# EAGLE design RMP - HALF BRIDGE 0.0.2 (EAGLE 9.6.2)

## Sheet 1 of 5
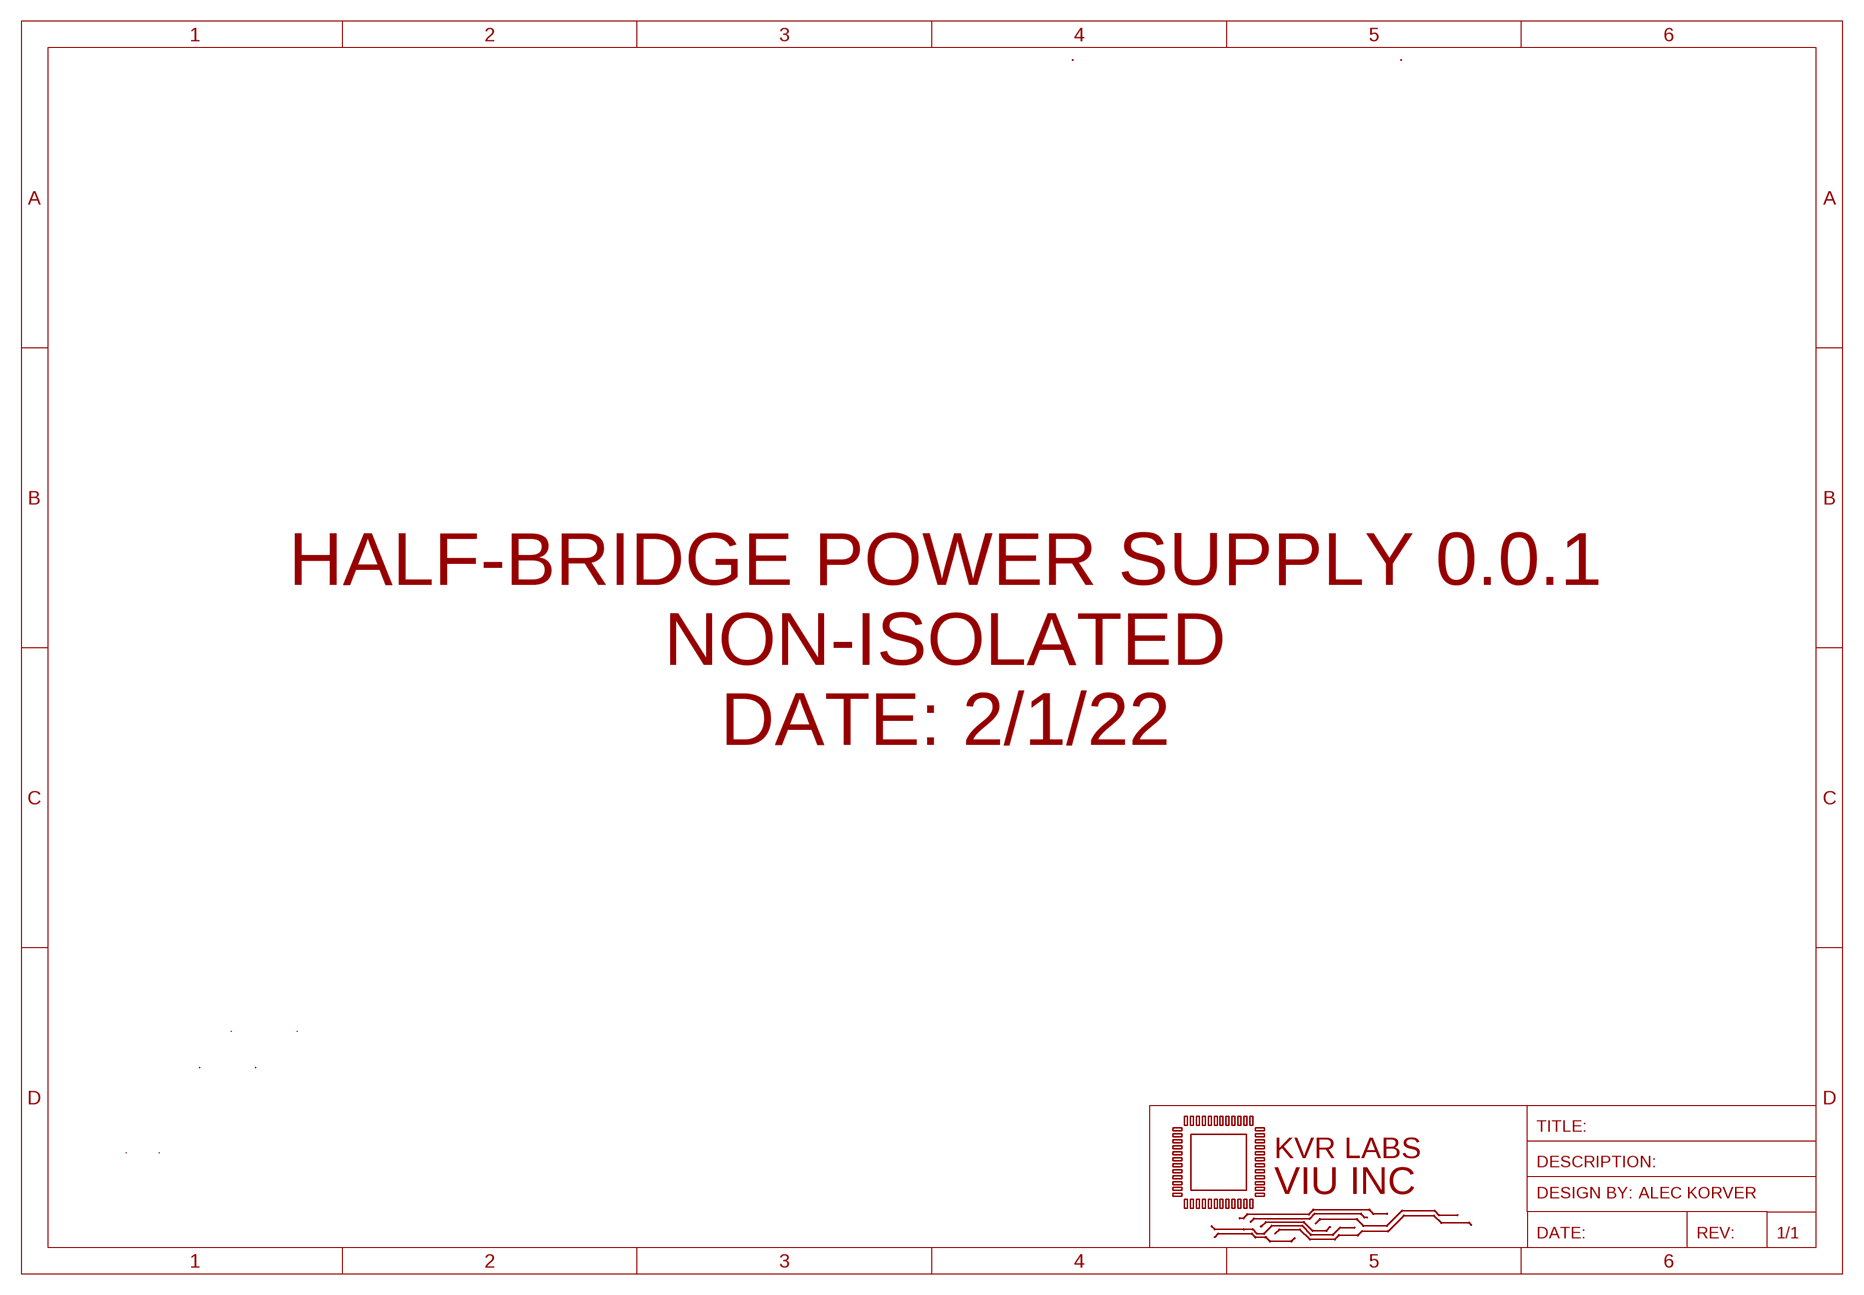
[diagram p0: schematic, sheet 1]

### Notes on the sheet
- HALF-BRIDGE POWER SUPPLY 0.0.1
  NON-ISOLATED
  DATE: 2/1/22

## Sheet 2 of 5: GATE DRIVERS
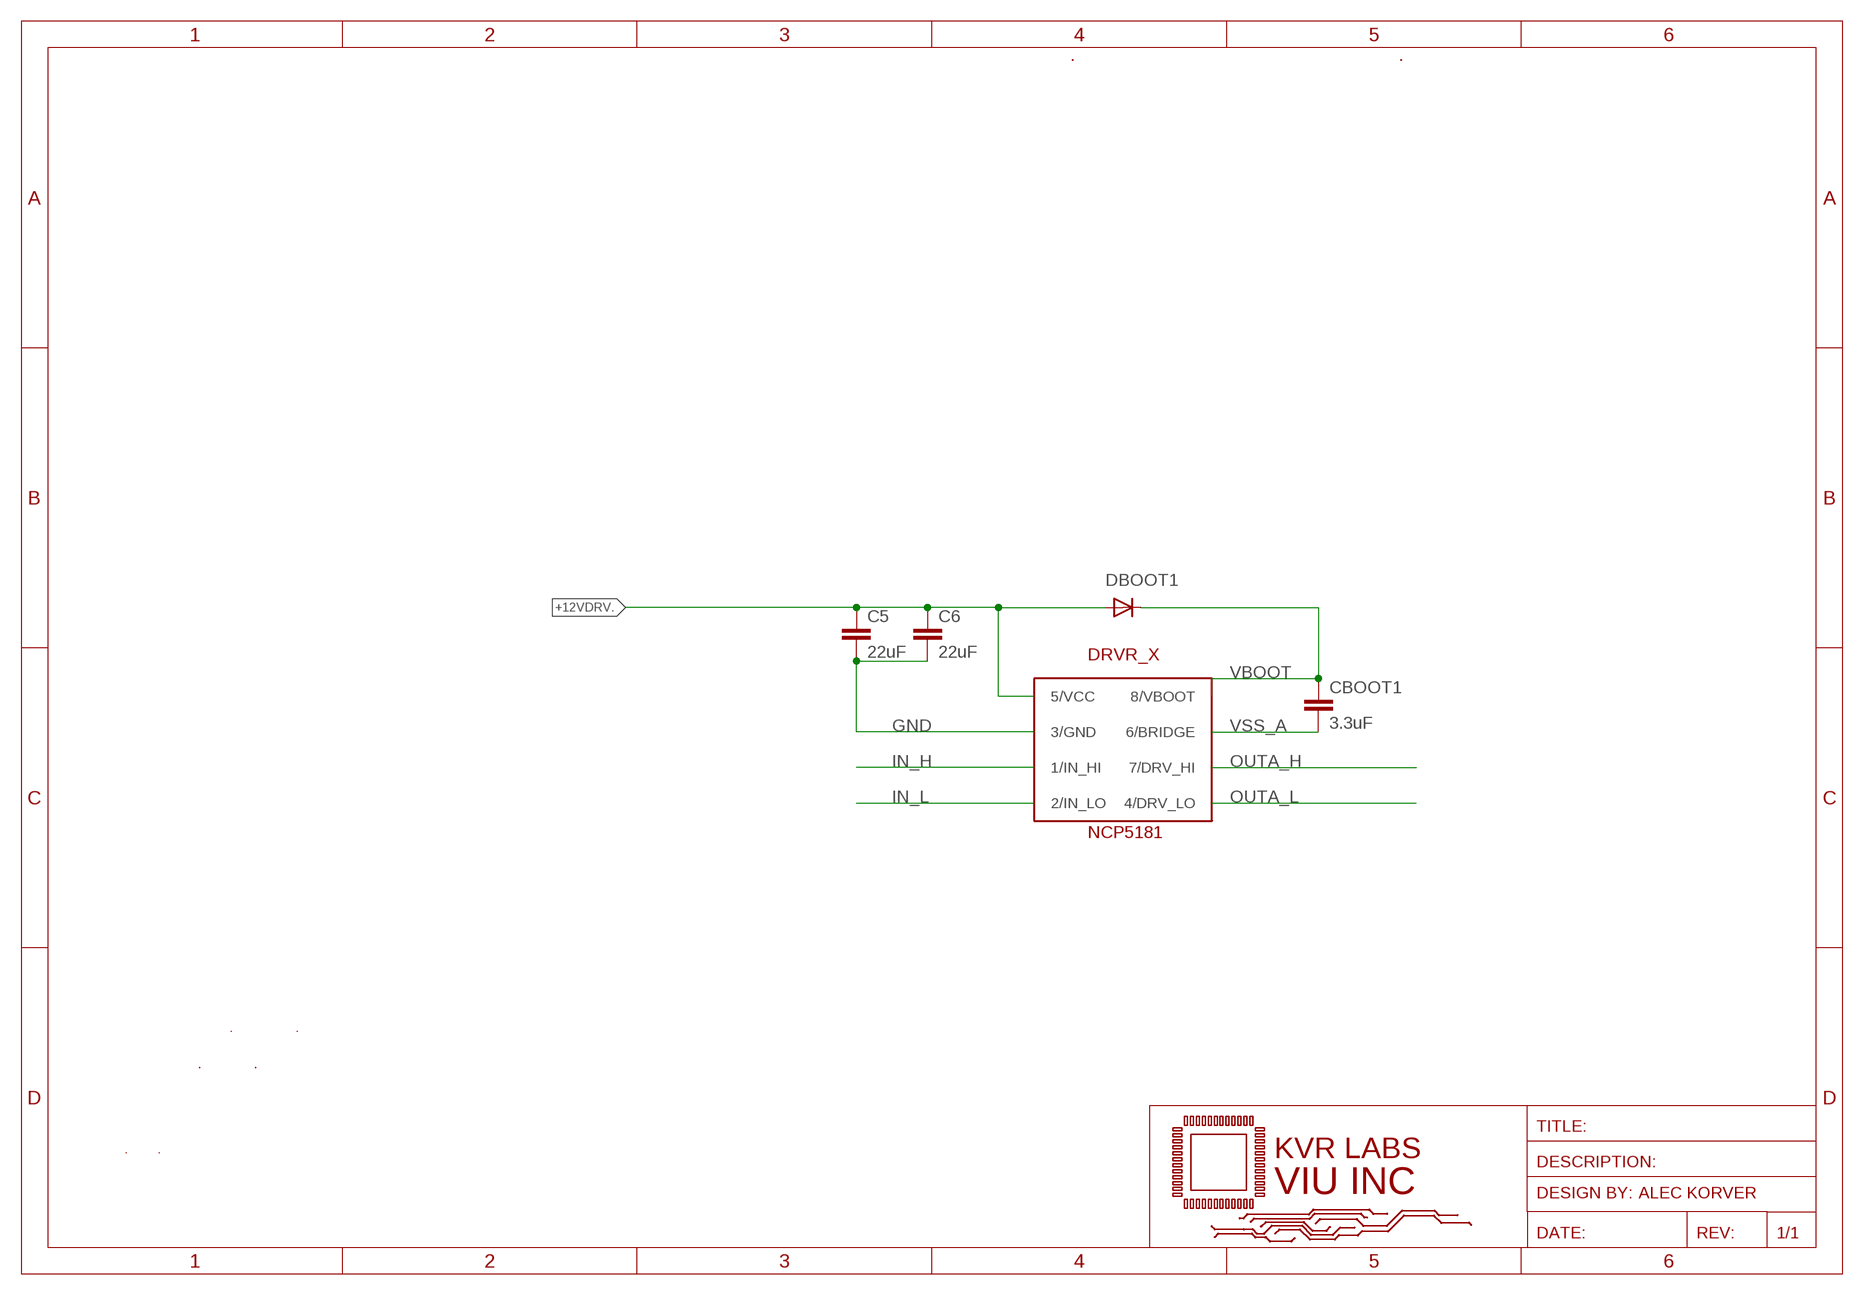
[diagram p1: schematic, sheet 2]

### Parts
C5  22uF  C-EUC1206  [C1206]
C6  22uF  C-EUC1206  [C1206]
CBOOT1  3.3uF  C-EUC1812  [C1812]
DBOOT1  DIODESMA  [SMADIODE]
DRVR_X  NCP5181  [8-SOIC]

### Nets
+12VDRV: C5.1 C6.1 DBOOT1.A DRVR_X.5(5/VCC) ; also sheet 4
GND: C5.2 C6.2 DRVR_X.3(3/GND) ; also sheet 3,4,5
IN_H: DRVR_X.1(1/IN_HI) ; also sheet 4
IN_L: DRVR_X.2(2/IN_LO) ; also sheet 4
OUTA_H: DRVR_X.7(7/DRV_HI) ; also sheet 3
OUTA_L: DRVR_X.4(4/DRV_LO) ; also sheet 3
VBOOT: CBOOT1.1 DBOOT1.C DRVR_X.8(8/VBOOT)
VSS_A: CBOOT1.2 DRVR_X.6(6/BRIDGE) ; also sheet 3,4

## Sheet 3 of 5: H BRIDGE - AC/DC STAGE
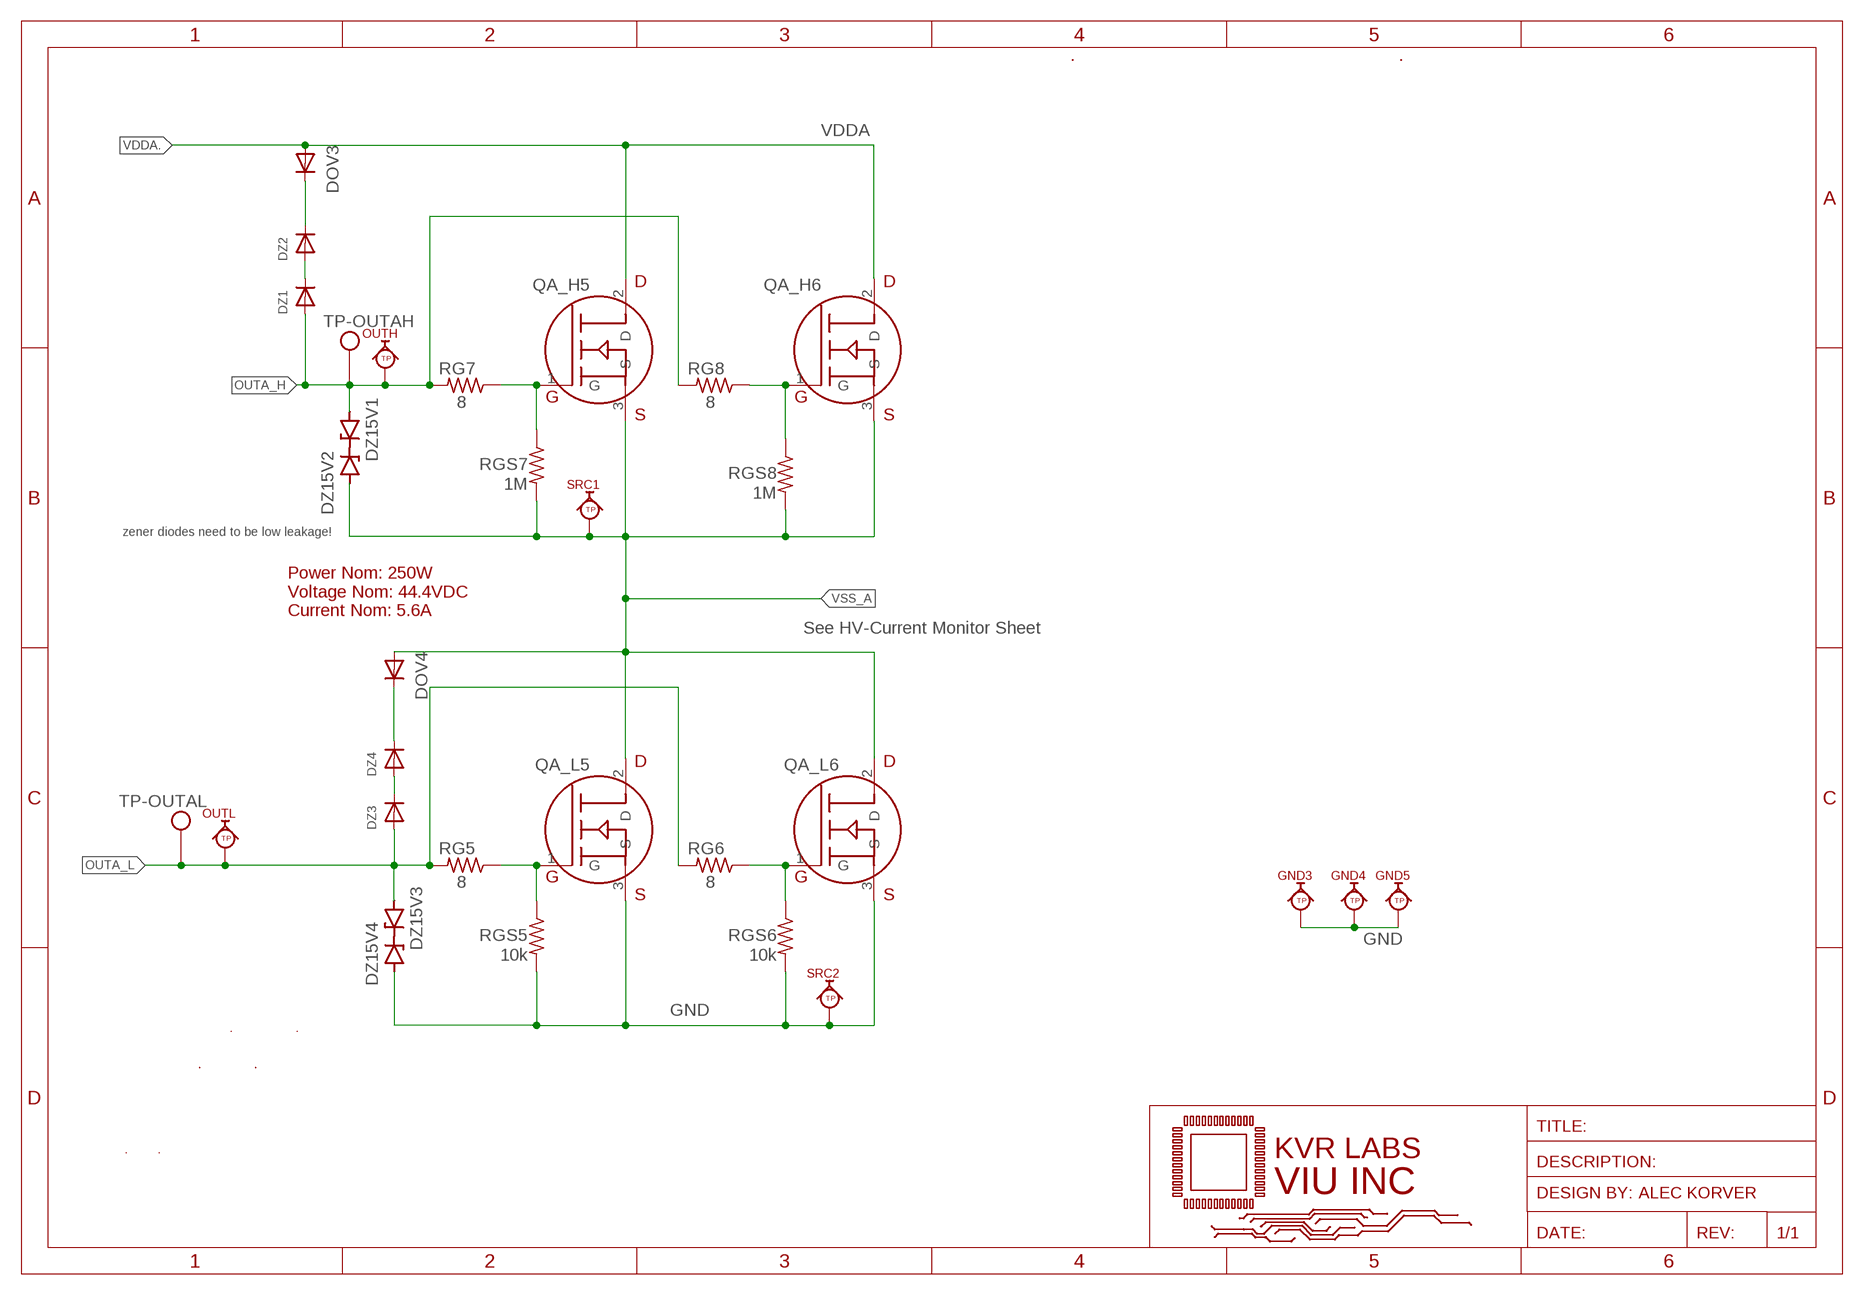
[diagram p2: schematic, sheet 3]

### Parts
DOV3  DIODESMA  [SMADIODE]
DOV4  DIODESMA  [SMADIODE]
DZ1  DIODESMA  [SMADIODE]
DZ2  DIODESMA  [SMADIODE]
DZ3  DIODESMA  [SMADIODE]
DZ4  DIODESMA  [SMADIODE]
DZ15V1  NZH15B,115  ZENER_MMSZ5240BTDO-219-AB(SOD123F)  [SODFL3718X115]
DZ15V2  NZH15B,115  ZENER_MMSZ5240BTDO-219-AB(SOD123F)  [SODFL3718X115]
DZ15V3  NZH15B,115  ZENER_MMSZ5240BTDO-219-AB(SOD123F)  [SODFL3718X115]
DZ15V4  NZH15B,115  ZENER_MMSZ5240BTDO-219-AB(SOD123F)  [SODFL3718X115]
GND3  KEYSTONE_5190_SMT  [KEYSTONE_5190_SMT]
GND4  KEYSTONE_5190_SMT  [KEYSTONE_5190_SMT]
GND5  KEYSTONE_5190_SMT  [KEYSTONE_5190_SMT]
OUTH  KEYSTONE_5190_SMT  [KEYSTONE_5190_SMT]
OUTL  KEYSTONE_5190_SMT  [KEYSTONE_5190_SMT]
QA_H5  IPB60R060P7ATMA1  [D2PACK]
QA_H6  IPB60R060P7ATMA1  [D2PACK]
QA_L5  IPB60R060P7ATMA1  [D2PACK]
QA_L6  IPB60R060P7ATMA1  [D2PACK]
RG5  8  R-US_R1206  [R1206]
RG6  8  R-US_R1206  [R1206]
RG7  8  R-US_R1206  [R1206]
RG8  8  R-US_R1206  [R1206]
RGS5  10k  R-US_R1206  [R1206]
RGS6  10k  R-US_R1206  [R1206]
RGS7  1M  R-US_R1206  [R1206]
RGS8  1M  R-US_R1206  [R1206]
SRC1  KEYSTONE_5190_SMT  [KEYSTONE_5190_SMT]
SRC2  KEYSTONE_5190_SMT  [KEYSTONE_5190_SMT]
TP-OUTAH  THM_TESTPOINT_5000_SERIES  [THM-TESTPOINT]
TP-OUTAL  THM_TESTPOINT_5000_SERIES  [THM-TESTPOINT]

### Nets
GND: DZ15V4.2(A) GND3.P$1 GND4.P$1 GND5.P$1 QA_L5.3(S) QA_L6.3(S) RGS5.2 RGS6.2 SRC2.P$1 ; also sheet 2,4,5
N$1: DZ1.C DZ2.A
N$2: DOV4.C DZ4.C
N$3: DZ3.C DZ4.A
N$31: DZ15V3.1(C) DZ15V4.1(C)
N$38: DZ15V1.1(C) DZ15V2.1(C)
N$43: QA_L6.1(G) RG6.1 RGS6.1
N$44: QA_H6.1(G) RG8.1 RGS8.1
N$45: QA_H5.1(G) RG7.1 RGS7.1
N$46: QA_L5.1(G) RG5.1 RGS5.1
N$47: DOV3.C DZ2.C
OUTA_H: DZ1.A DZ15V1.2(A) OUTH.P$1 RG7.2 RG8.2 TP-OUTAH.P1 ; also sheet 2
OUTA_L: DZ3.A DZ15V3.2(A) OUTL.P$1 RG5.2 RG6.2 TP-OUTAL.P1 ; also sheet 2
VDDA: DOV3.A QA_H5.2(D) QA_H6.2(D) ; also sheet 4,5
VSS_A: DOV4.A DZ15V2.2(A) QA_H5.3(S) QA_H6.3(S) QA_L5.2(D) QA_L6.2(D) RGS7.2 RGS8.2 SRC1.P$1 ; also sheet 2,4

### Notes on the sheet
- zener diodes need to be low leakage!
- Power Nom: 250W
  Voltage Nom: 44.4VDC
  Current Nom: 5.6A
- See HV-Current Monitor Sheet

## Sheet 4 of 5: CONNECTORS
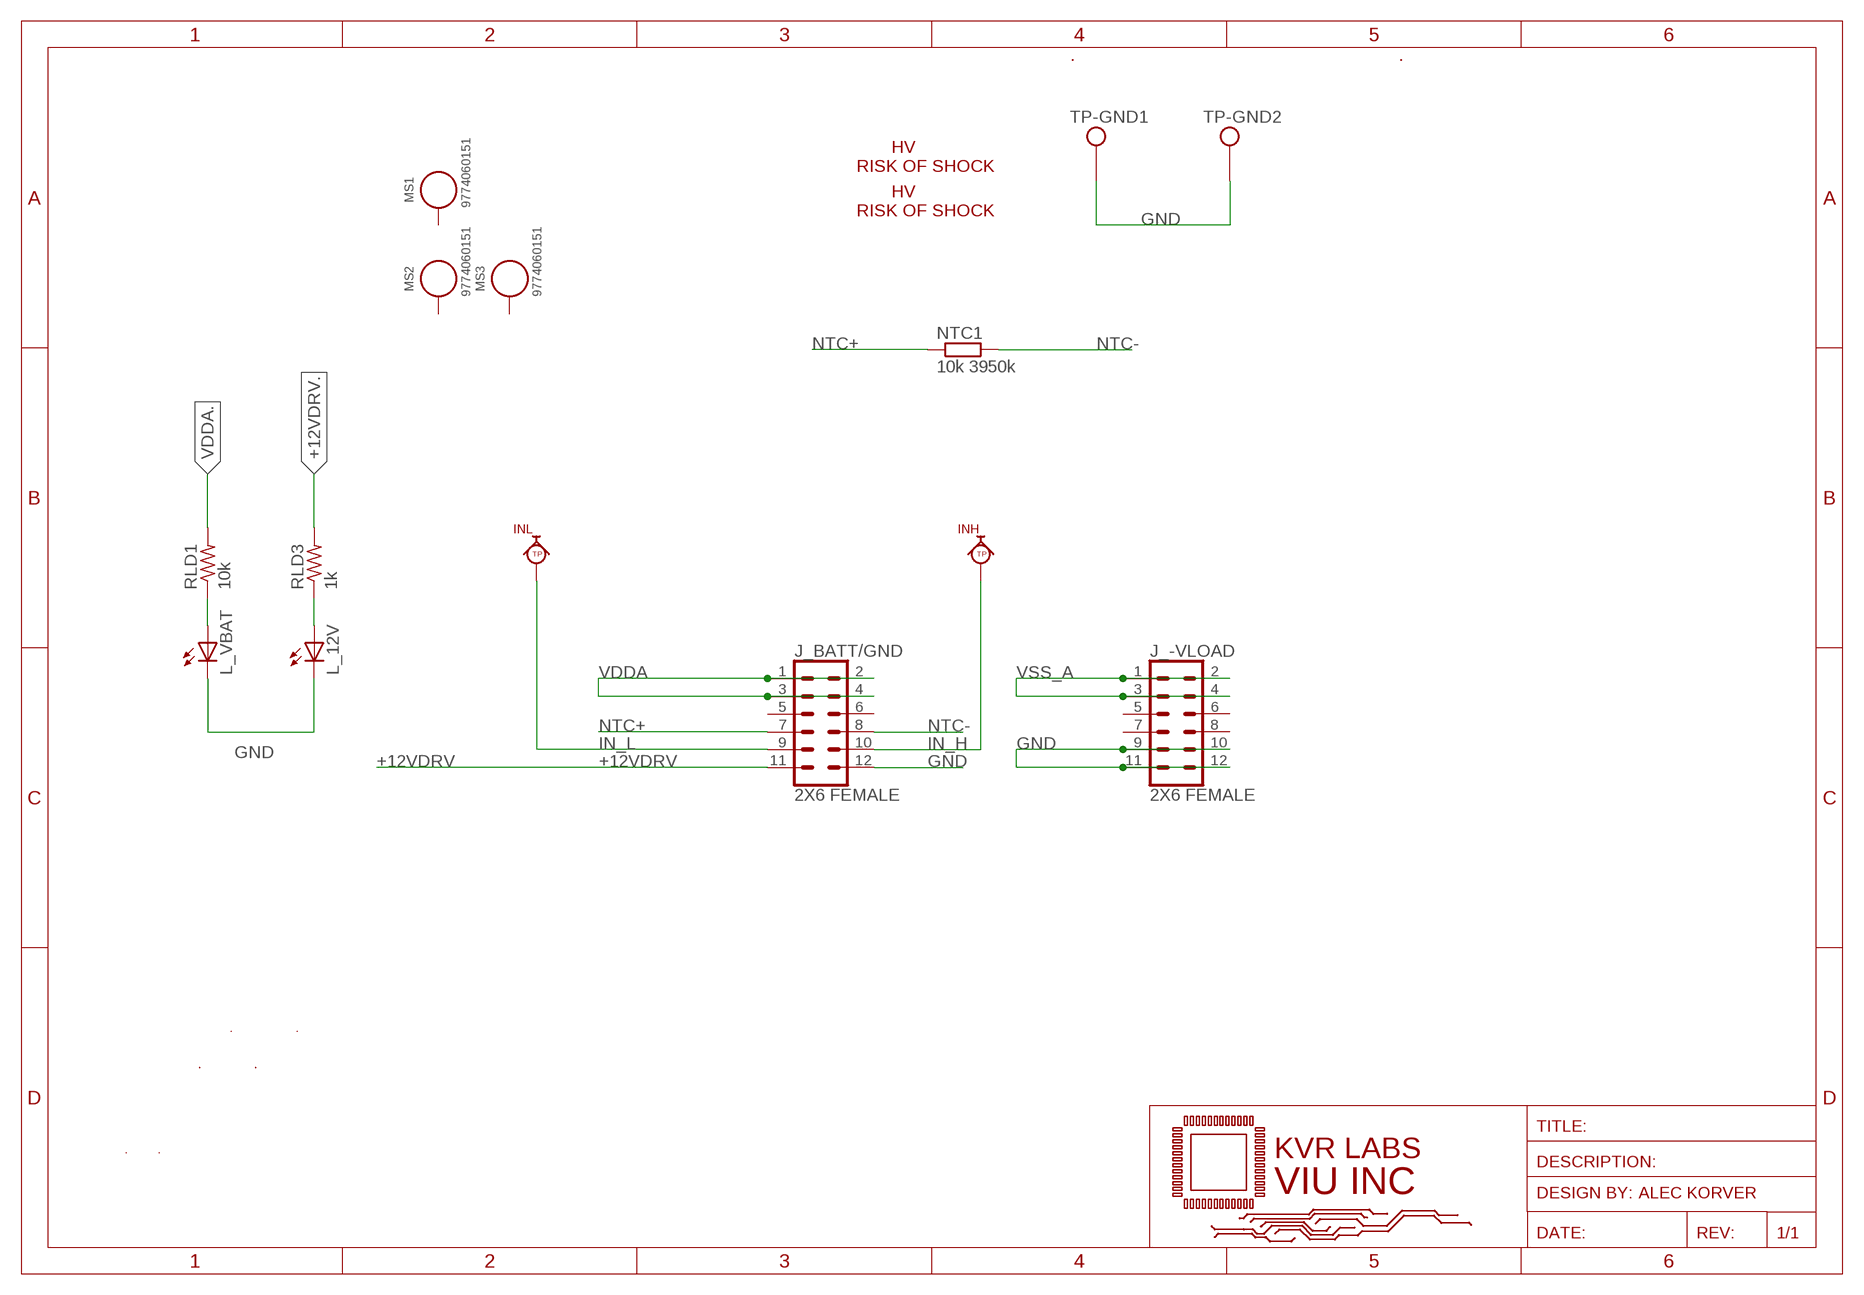
[diagram p3: schematic, sheet 4]

### Parts
INH  KEYSTONE_5190_SMT  [KEYSTONE_5190_SMT]
INL  KEYSTONE_5190_SMT  [KEYSTONE_5190_SMT]
J_-VLOAD  2X6 FEMALE  CONN_06X2PTH_FEMALE  [2X6]
J_BATT/GND  2X6 FEMALE  CONN_06X2PTH_FEMALE  [2X6]
L_12V  LEDCHIPLED_1206  [CHIPLED_1206]
L_VBAT  LEDCHIPLED_1206  [CHIPLED_1206]
MS1  9774060151  WA-SMSI_9774XXX151_9774060151  [WA-SMSI_9774060151]
MS2  9774060151  WA-SMSI_9774XXX151_9774060151  [WA-SMSI_9774060151]
MS3  9774060151  WA-SMSI_9774XXX151_9774060151  [WA-SMSI_9774060151]
NTC1  10k 3950k  R-EU_R0805  [R0805]
RLD1  10k  R-US_R1206  [R1206]
RLD3  1k  R-US_R1206  [R1206]
TP-GND1  THM_TESTPOINT_5000_SERIES  [THM-TESTPOINT]
TP-GND2  THM_TESTPOINT_5000_SERIES  [THM-TESTPOINT]
U$10  ELECTRIC_SHOCK  [ELECTRIC_SHOCK]
U$11  ELECTRIC_SHOCK  [ELECTRIC_SHOCK]

### Nets
+12VDRV: J_BATT/GND.11 RLD3.2 ; also sheet 2
GND: J_-VLOAD.9 J_-VLOAD.10 J_-VLOAD.11 J_-VLOAD.12 J_BATT/GND.12 L_12V.C L_VBAT.C TP-GND1.P1 TP-GND2.P1 ; also sheet 2,3,5
IN_H: INH.P$1 J_BATT/GND.10 ; also sheet 2
IN_L: INL.P$1 J_BATT/GND.9 ; also sheet 2
N$17: L_VBAT.A RLD1.1
N$20: L_12V.A RLD3.1
NTC+: J_BATT/GND.7 NTC1.1
NTC-: J_BATT/GND.8 NTC1.2
VDDA: J_BATT/GND.1 J_BATT/GND.2 J_BATT/GND.3 J_BATT/GND.4 RLD1.2 ; also sheet 3,5
VSS_A: J_-VLOAD.1 J_-VLOAD.2 J_-VLOAD.3 J_-VLOAD.4 ; also sheet 2,3
Unconnected: J_-VLOAD.5 J_-VLOAD.6 J_-VLOAD.7 J_-VLOAD.8 J_BATT/GND.5 J_BATT/GND.6 MS1.1 MS2.1 MS3.1

## Sheet 5 of 5: CERAMIC DC LINK CAPACITANCE
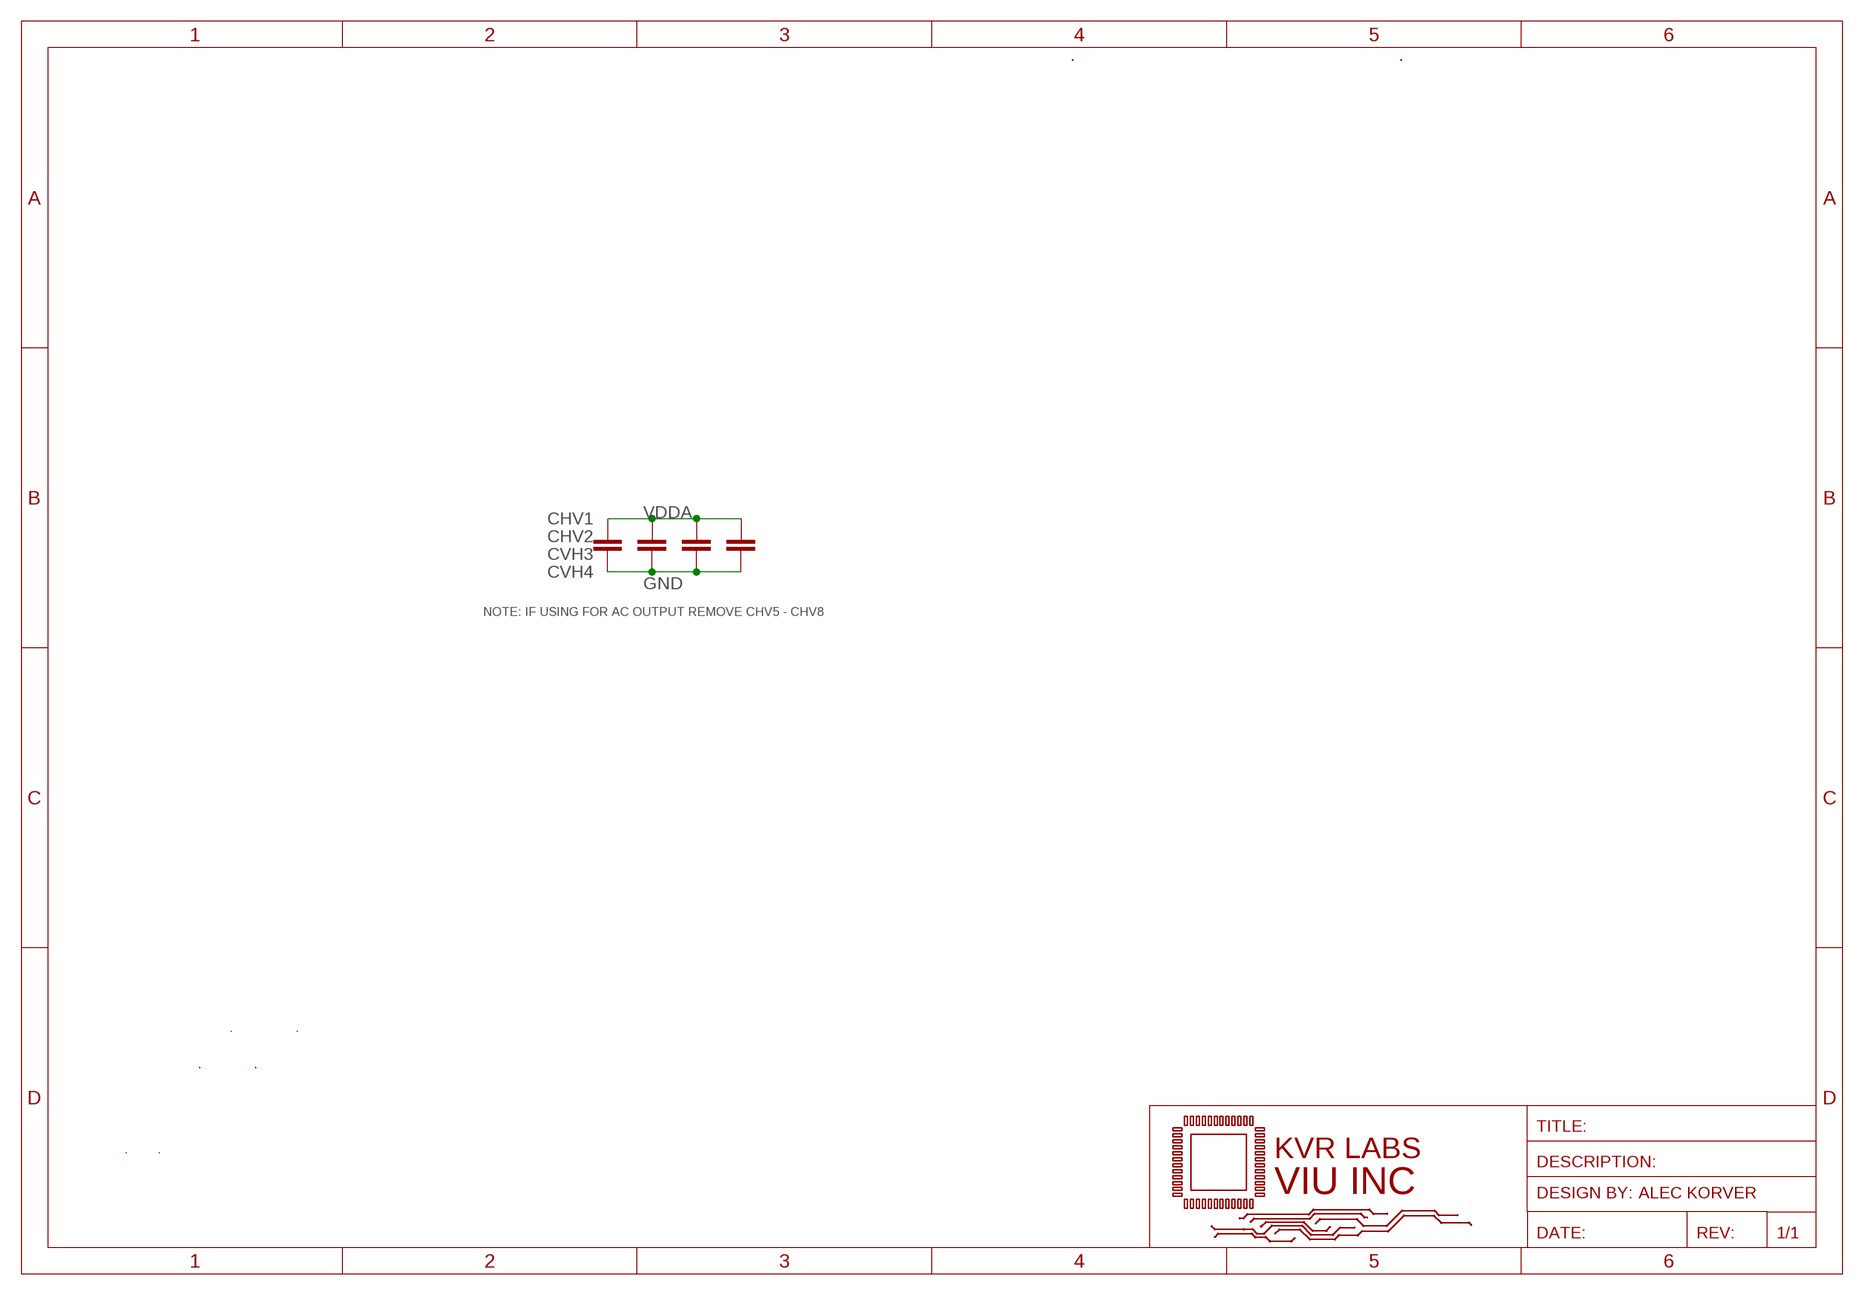
[diagram p4: schematic, sheet 5]

### Parts
CHV1  3.3uF, 100V  C-EUC2220K  [C2220K]
CHV2  3.3uF, 100V  C-EUC2220K  [C2220K]
CVH3  3.3uF, 100V  C-EUC2220K  [C2220K]
CVH4  3.3uF, 100V  C-EUC2220K  [C2220K]

### Nets
GND: CHV1.2 CHV2.2 CVH3.2 CVH4.2 ; also sheet 2,3,4
VDDA: CHV1.1 CHV2.1 CVH3.1 CVH4.1 ; also sheet 3,4

### Notes on the sheet
- NOTE: IF USING FOR AC OUTPUT REMOVE CHV5 - CHV8

## Library data of the parts
C5 C6 = rcl:C-EU: CAPACITOR, European symbol; LCSC_PART: C77091; SPICEPREFIX: C
CBOOT1 = rcl:C-EU: CAPACITOR, European symbol; LCSC_PART: C342636; SPICEPREFIX: C
CHV1 CHV2 CVH3 CVH4 = rcl:C-EU: CAPACITOR, European symbol; LCSC_PART: DNP/C342270; SPICEPREFIX: C
DBOOT1 = adafruit:DIODE: Diode SMADIODE - SMA Surface Mount Package 20V 1A Schottky Diode Digikey: 641-1014-6-ND DO-1N4148 - Through Hole Small Current Diode SOD-123 20V 1 A (.5mV Vf) Schottky Diode - Digikey: MBRX120TPMSCT-ND SOD-323 10V 570mA (.38mV Vf, 3ns) Schottky Diode - Digikey: ZLLS410CT-ND SOD-523 30V 30mA Schottky Diode (RB751S-40TE61) - Digikey: RB751S-40TE61CT-ND SOT23-R/W - SOT23 Package (R = Solder Paste/Reflow Ovens, W = Hand-Soldering) BAT54Film 40V 300mA - Digikey: 497-7162-1-ND; LCSC_PART: C110531
DOV3 DOV4 = adafruit:DIODE: Diode SMADIODE - SMA Surface Mount Package 20V 1A Schottky Diode Digikey: 641-1014-6-ND DO-1N4148 - Through Hole Small Current Diode SOD-123 20V 1 A (.5mV Vf) Schottky Diode - Digikey: MBRX120TPMSCT-ND SOD-323 10V 570mA (.38mV Vf, 3ns) Schottky Diode - Digikey: ZLLS410CT-ND SOD-523 30V 30mA Schottky Diode (RB751S-40TE61) - Digikey: RB751S-40TE61CT-ND SOT23-R/W - SOT23 Package (R = Solder Paste/Reflow Ovens, W = Hand-Soldering) BAT54Film 40V 300mA - Digikey: 497-7162-1-ND; I_AVG: 1A; LCSC_PART: C110531; VF: 1.3V; VR: 400V
DRVR_X = KVRLABS-Gatedrivers:NCP5181; LCSC_PART: DNP
DZ1-DZ4 = adafruit:DIODE: Diode SMADIODE - SMA Surface Mount Package 20V 1A Schottky Diode Digikey: 641-1014-6-ND DO-1N4148 - Through Hole Small Current Diode SOD-123 20V 1 A (.5mV Vf) Schottky Diode - Digikey: MBRX120TPMSCT-ND SOD-323 10V 570mA (.38mV Vf, 3ns) Schottky Diode - Digikey: ZLLS410CT-ND SOD-523 30V 30mA Schottky Diode (RB751S-40TE61) - Digikey: RB751S-40TE61CT-ND SOT23-R/W - SOT23 Package (R = Solder Paste/Reflow Ovens, W = Hand-Soldering) BAT54Film 40V 300mA - Digikey: 497-7162-1-ND; LCSC_PART: C362303; MODEL: BZG03C180; VZ_NOM: 180V
DZ15V1-DZ15V4 = Diode:ZENER_: Zener Diode - Popular parts; CATEGORY: Diode; DESCRIPTION: DIODE ZENER 10V 500MW SOD123; LCSC_PART: C173428; MANUFACTURER: ON Semiconductor; MPN: MMSZ5240BT1G; SUB-CATEGORY: Zener; THERMALLOSS: 0.5W; VALUE: MMSZ5240BT1G
GND3-GND5 INH INL OUTH OUTL SRC1 SRC2 = KVRLABS-Test Points:KEYSTONE_5190_SMT
J_-VLOAD J_BATT/GND = SparkFun-Connectors:CONN_06X2: Multi connection point. Often used as Generic Header-pin footprint for 0.1 inch spaced/style header connections On any of the 0.1 inch spaced packages, you can populate with these: Break Away Headers - Straight <https://www.sparkfun.com/products/116> (PRT-00116) Break Away Male Headers - Right Angle <https://www.sparkfun.com/products/553> (PRT-00553) Female Headers <https://www.sparkfun.com/products/115> (PRT-00115) Break Away Headers - Machine Pin <https://www.sparkfun.com/products/117> (PRT-00117) Break Away Female Headers - Swiss Machine Pin <https://www.sparkfun.com/products/743> (PRT-00743); LCSC_PART: DNP; MODEL: TSW-106-05-G-D; PROD_ID: CONN-12423
L_12V L_VBAT = adafruit:LED: LED OSRAM: - CHIPLED LG R971, LG N971, LY N971, LG Q971, LY Q971, LO R971, LY R971 LH N974, LH R974 LS Q976, LO Q976, LY Q976 LO Q996 - Hyper CHIPLED LW Q18S LB Q993, LB Q99A, LB R99A - SideLED LS A670, LO A670, LY A670, LG A670, LP A670 LB A673, LV A673, LT A673, LW A673 LH A674 LY A675 LS A676, LA A676, LO A676, LY A676, LW A676 LS A679, LY A679, LG A679 - Hyper Micro SIDELED® LS Y876, LA Y876, LO Y876, LY Y876 LT Y87S - SmartLED LW L88C, LW L88S LB L89C, LB L89S, LG L890 LS L89K, LO L89K, LY L89K LS L896, LA L896, LO L896, LY L896 - TOPLED LS T670, LO T670, LY T670, LG T670, LP T670 LSG T670, LSP T670, LSY T670, LOP T670, LYG T670 LG T671, LOG T671, LSG T671 LB T673, LV T673, LT T673, LW T673 LH T674 LS T676, LA T676, LO T676, LY T676, LB T676, LH T676, LSB T676, LW T676 LB T67C, LV T67C, LT T67C, LS T67K, LO T67K, LY T67K, LW E67C LS E67B, LA E67B, LO E67B, LY E67B, LB E67C, LV E67C, LT E67C LW T67C LS T679, LY T679, LG T679 LS T770, LO T770, LY T770, LG T770, LP T770 LB T773, LV T773, LT T773, LW T773 LH T774 LS E675, LA E675, LY E675, LS T675 LS T776, LA T776, LO T776, LY T776, LB T776 LHGB T686 LT T68C, LB T68C - Hyper Mini TOPLED® LB M676 - Mini TOPLED Santana® LG M470 LS M47K, LO M47K, LY M47K Source: http://www.osram.convergy.de/; LCSC_PART: C434439
MS1-MS3 = Eagle_WA-SMSI (rev20d) (1):WA-SMSI_9774XXX151: WA-SMSI SMT Steel Spacer, M2.5 Thread Internal PROPERTIES Material Steel Surface Tin GENERAL INFORMATION Operating Temperature -55 up to +150 °C PACKAGING PROPERTIES Packaging Bag;​ Tape and Reel;​ Bulk Packaging Unit 450 <https://katalog.we-online.de/media/images/v2/o92910v209%20Family_WA-SMSI_M2-M2.5.jpg> Details see: https://katalog.we-online.de/en/em/SMSI_SMT_STEEL_SPACER_M2_5_THREAD_INTERNAL Updated by Ella Wu 2020-05-18 2020(C) Wurth Elektronik; DATASHEET-URL: https://www.we-online.de/katalog/datasheet/9774060151.pdf; INNER-DIAMETER: 3.5mm; INNER-THREAD-LENGTH: -; LCSC_PART: DNP; OUTER-DIAMETER: 5.1mm; PART-NUMBER: 9774060151; PIN-LENGTH: 6mm; THREAD: M2.5
NTC1 = rcl:R-EU_: RESISTOR, European symbol; BETA: 3950K; LCSC_PART: C95968; RESISTANCE: 10k; SPICEPREFIX: R
QA_H5 QA_H6 QA_L5 QA_L6 = PSFBC:IPB60R060P7ATMA1: IPB60R060P7ATMA1 VDS: 650V Id: 48A(Tc) Rdson: 60mOhm Vgsth: 4V https://www.digikey.com/product-detail/en/infineon-technologies/IPB60R060P7ATMA1/IPB60R060P7ATMA1CT-ND/8259678; CISS: 4050pF; COSS: 1480pF; CRSS: 58pF; LCSC_PART: C604524; MODEL: SQM10250E_GE3; QGC: 75nC; RDSON: 30mOhm; TDELAY: 60ns; TFALL: 20ns; TRISE: 30ns; VDS: 250V; VGSMAX: +/- 20V; VGSTH: 3.5V
RG5-RG8 = rcl:R-US_: RESISTOR, American symbol; LCSC_PART: C118070; SPICEPREFIX: R
RGS5 RGS6 RLD1 = rcl:R-US_: RESISTOR, American symbol; LCSC_PART: C140407; SPICEPREFIX: R
RGS7 RGS8 = rcl:R-US_: RESISTOR, American symbol; LCSC_PART: C105578; SPICEPREFIX: R
RLD3 = rcl:R-US_: RESISTOR, American symbol; LCSC_PART: C115421; SPICEPREFIX: R
TP-GND1 TP-GND2 TP-OUTAH TP-OUTAL = PSFBC:THM_TESTPOINT_5000_SERIES; LCSC_PART: DNP
U$10 U$11 = PSFBC:ELECTRIC_SHOCK; LCSC_PART: DNP

## Net classes
0 default: width 0.089 mm, drill 0.2 mm, clearance 0.089 mm

## Board
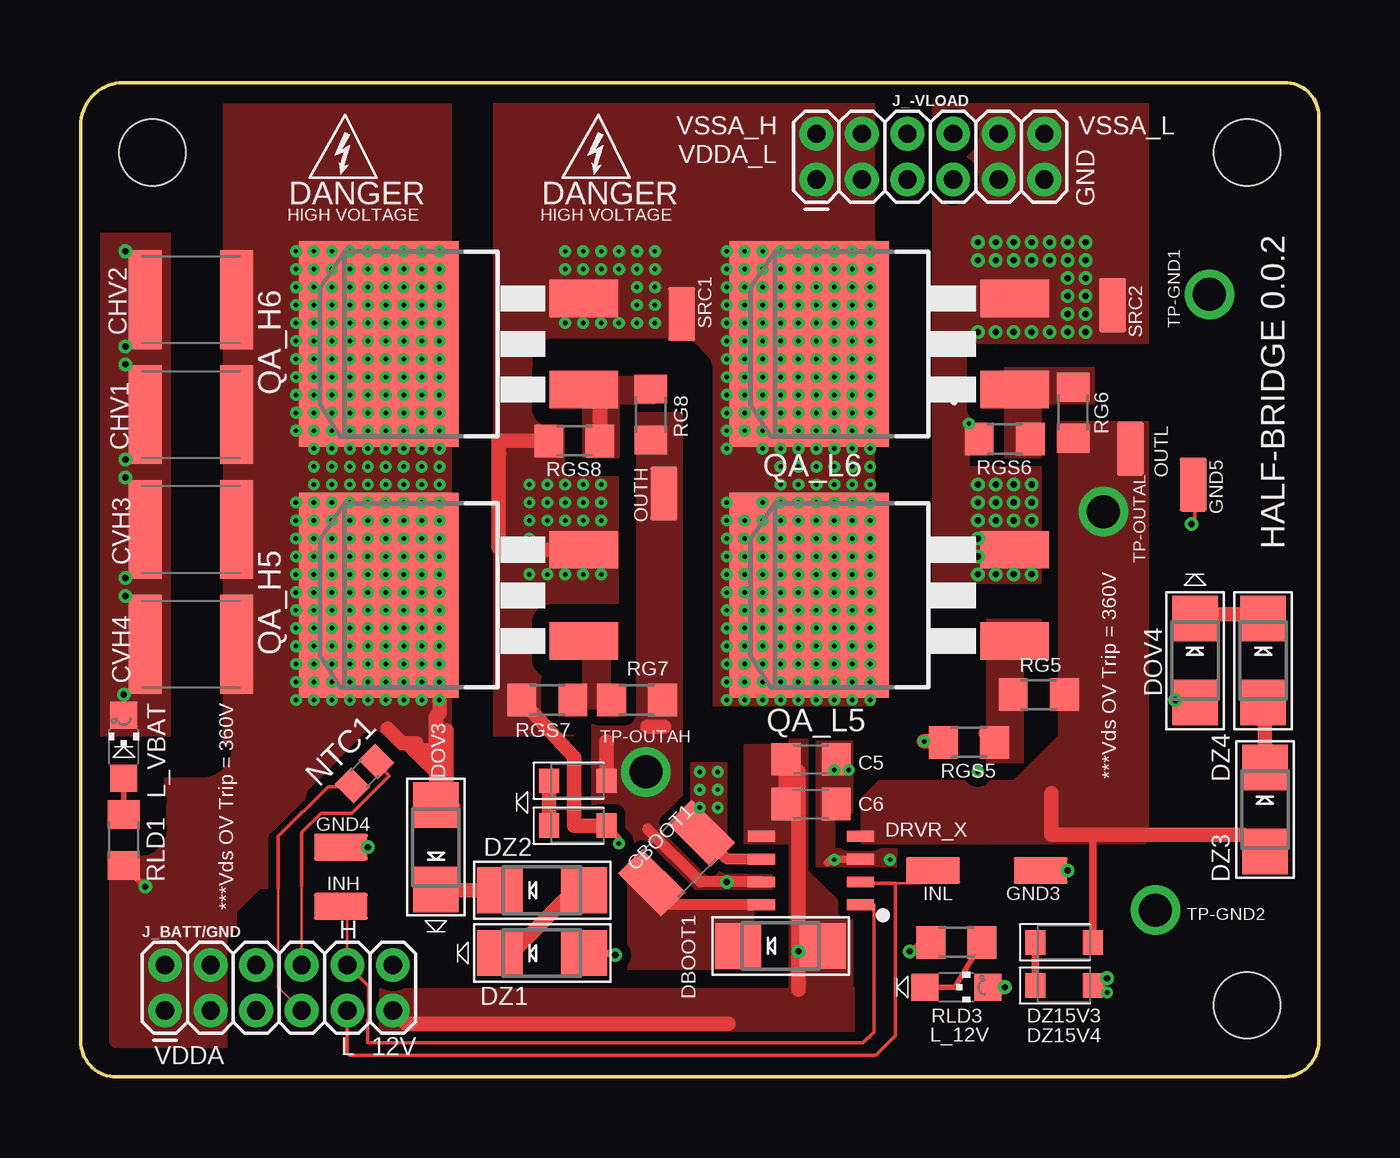
[diagram p5: board, top side]
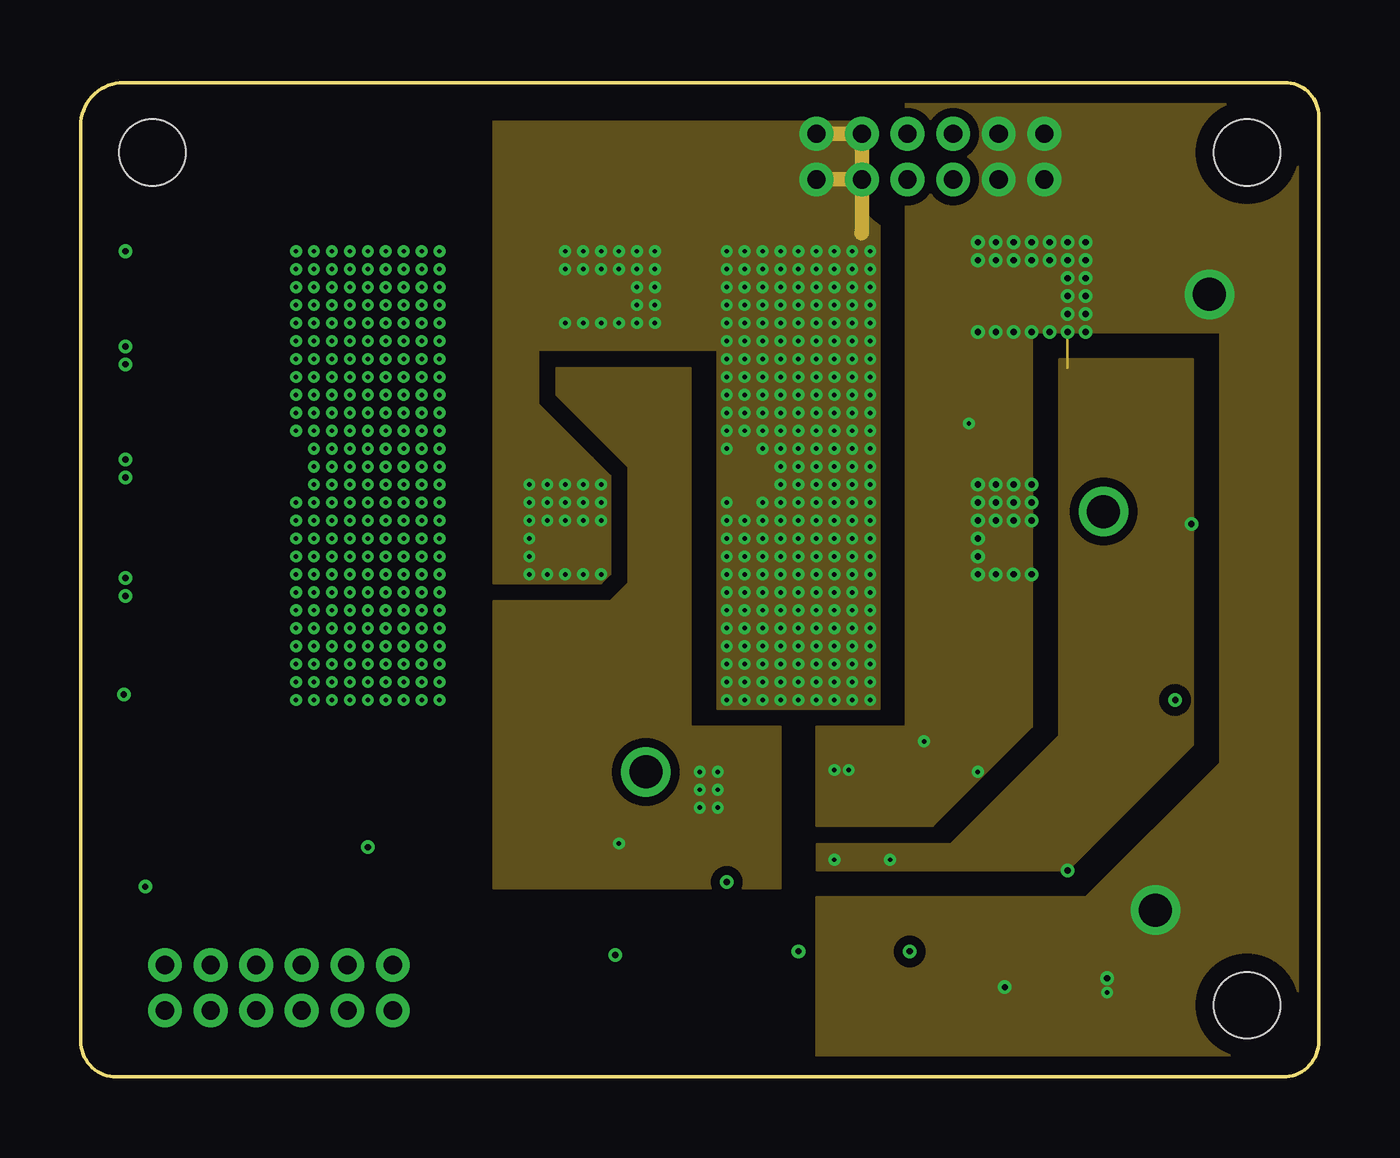
[diagram p6: board, inner layer Route2]
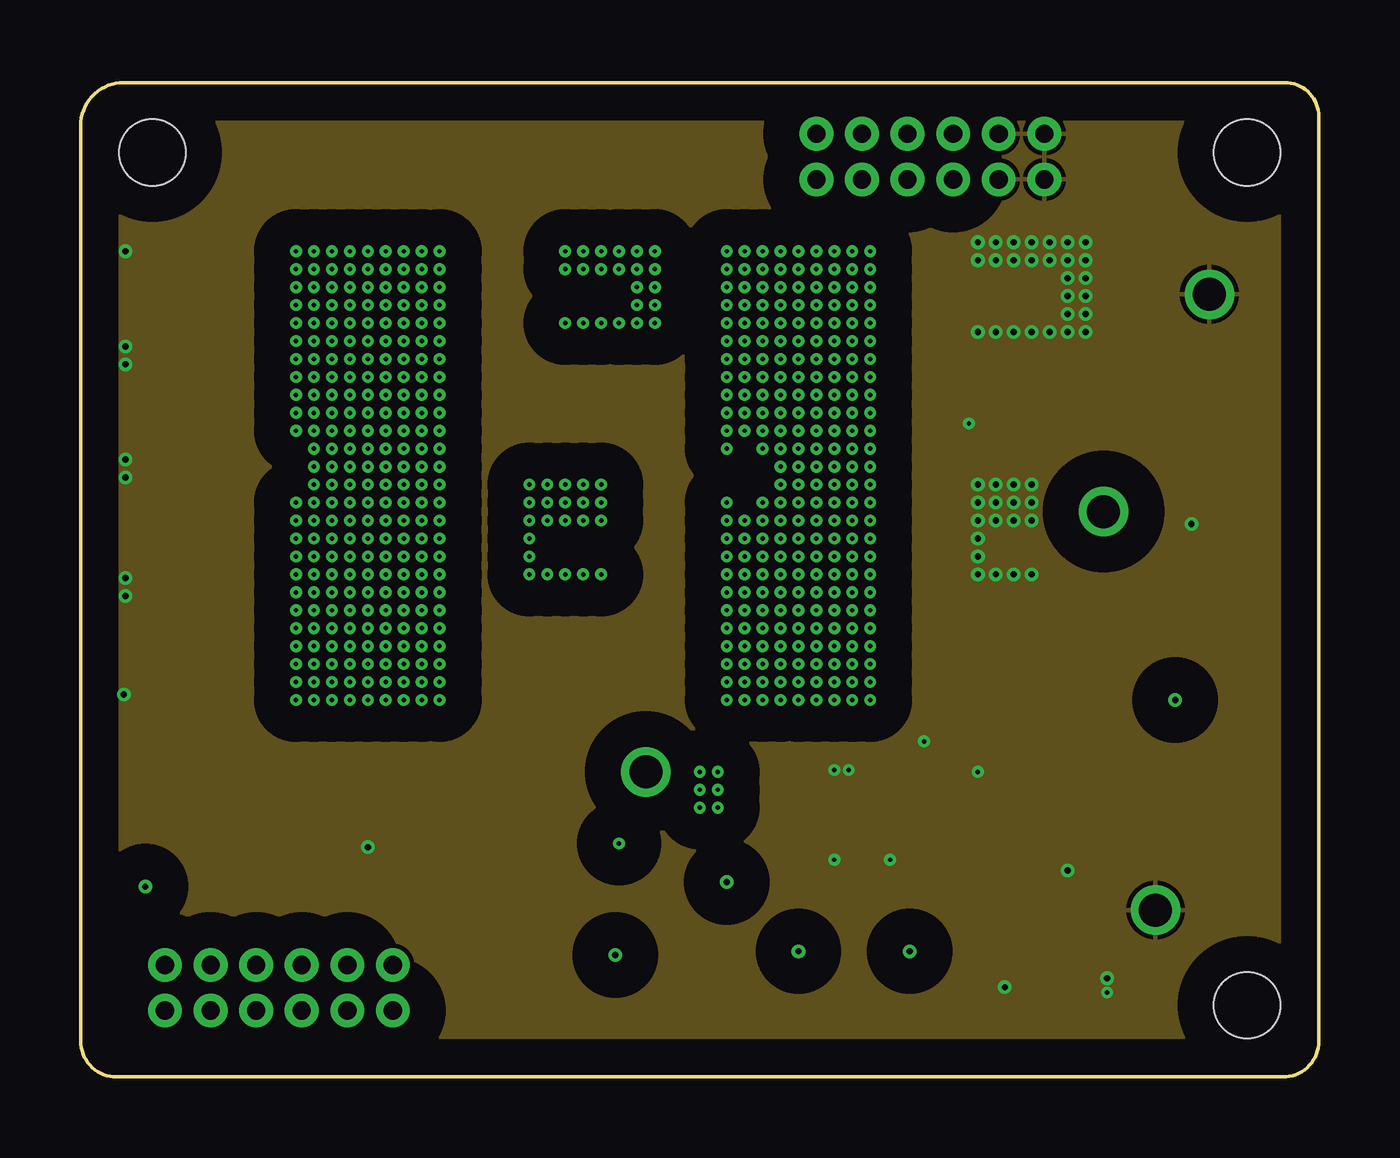
[diagram p7: board, inner layer Route15]
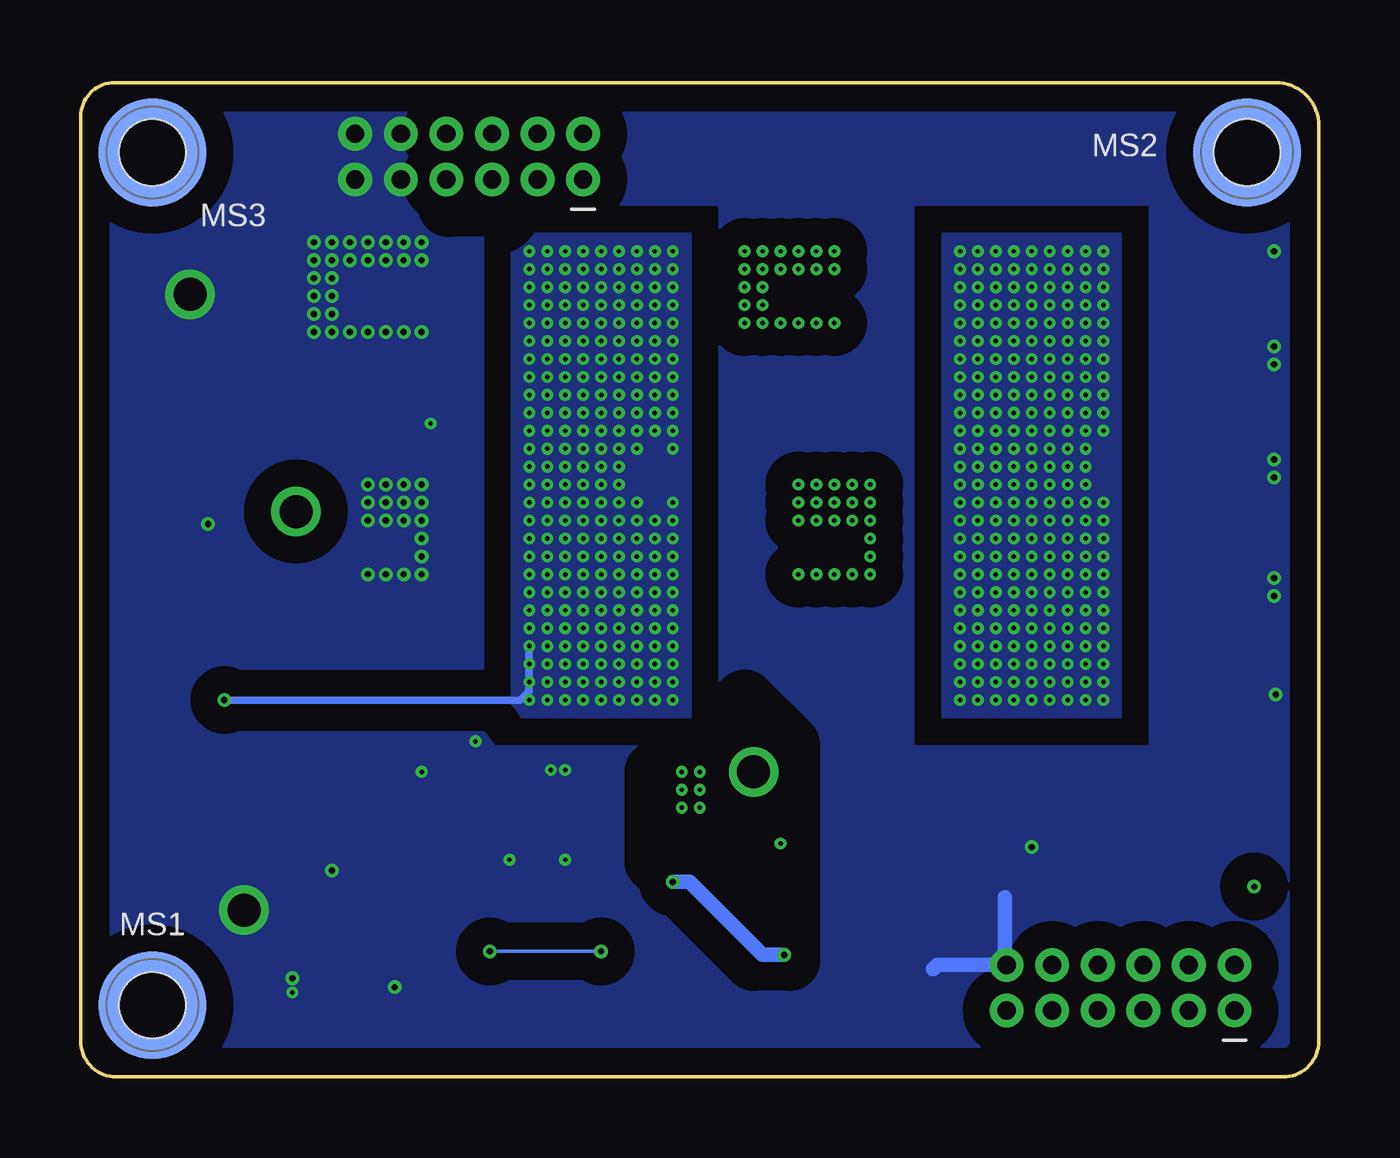
[diagram p8: board, bottom side, seen from below]

Size 69 x 55.4 mm. Coordinates in mm from the lower left corner, seen from the top.
Outline: 0,2 0,53 arc-90 2.4,55.4 67.1,55.4 arc-90 69,53.5 69,2 arc-90 67,0 2,0 arc-90 0,2
Copper layers (1*2*15*16): Top 0.035mm / dielectric 1.5mm / Route2 0.035mm / dielectric 0.15mm / Route15 0.035mm / dielectric 0.2mm / Bottom 0.035mm
Design rules "default *": minimum track width 6mil, minimum drill 0.35mm, track to track 6mil, track to pad 6mil, pad to pad 6mil, via to via 6mil, smd to smd 6mil, copper to edge 40mil, drill to drill 6mil, minimum pad ring 10mil, minimum via ring 8mil, stop-mask expansion 4mil, vias tented up to drill 0mil, thermal gap 10mil
tRestrict: 30 lines
bRestrict: 7 lines
vRestrict: 1 lines

### Footprints (pad centres in the part's own frame; a part is rotated, then mirrored left to right if it is on the bottom)
C1206 = smd 1.6 x 1.8: 1 -1.4,0; 2 1.4,0
C1812 = smd 1.9 x 3.4: 1 -1.95,0; 2 1.95,0
C2220K = smd 1.85 x 5.5: 1 -2.55,0; 2 2.55,0
SMADIODE = smd 2.54 x 2.54: A 2.349,0; C -2.349,0
8-SOIC = smd 0.6 x 1.52: 1 -1.905,-2.76; 2 -0.635,-2.76; 3 0.635,-2.76; 4 1.905,-2.76; 5 1.905,2.76; 6 0.635,2.76; 7 -0.635,2.76; 8 -1.905,2.76
SODFL3718X115 = smd 1.115 x 1.361: 1 -1.6,0; 2 1.6,0
KEYSTONE_5190_SMT = smd 1.5 x 3: P$1 0,0
2X6 = drill 1.016 pad 1.88: 1 0,0; 2 0,2.54; 3 2.54,0; 4 2.54,2.54; 5 5.08,0; 6 5.08,2.54; 7 7.62,0; 8 7.62,2.54; 9 10.16,0; 10 10.16,2.54; 11 12.7,0; 12 12.7,2.54
CHIPLED_1206 = smd 1.5 x 1.5: A 0,-1.75; C 0,1.75
WA-SMSI_9774060151 = smd 6 x 6: 1 0,0 | hole 3.7: 0,0
R0805 = smd 1.3 x 1.5: 1 -0.95,0; 2 0.95,0
D2PACK = smd 2.083 x 3.81: 1 -2.54,-8.89; 3 2.54,-8.89 | smd 11.43 x 8.89: 2 0,2.54
R1206 = smd 1.6 x 1.803: 1 -1.422,0; 2 1.422,0
THM-TESTPOINT = drill 1.84: P1 0,0

### Placement (x,y rotation side)
C5  40.7,17.7 0 top
C6  40.7,15.2 0 top
CBOOT1  33.2,12.2 45 top
CHV1  6.15,36.9 180 top
CHV2  6.15,43.3 180 top
CVH3  6.15,30.5 180 top
CVH4  6.15,24.1 180 top
DBOOT1  39,7.3 0 top
DOV3  19.8,12.8 90 top
DOV4  62.1,23.2 270 top
DRVR_X  40.7,11.5 90 top
DZ1  25.7,6.9 0 top
DZ2  25.7,10.4 0 top
DZ3  66,14.9 270 top
DZ4  65.9,23.2 270 top
DZ15V1  27.7,16.5 0 top
DZ15V2  27.7,14 0 top
DZ15V3  54.8,7.5 0 top
DZ15V4  54.8,5.1 0 top
GND3  53.5,11.5 90 top
GND4  14.5,12.8 270 top
GND5  62,33 180 top
INH  14.5,9.5 270 top
INL  47.5,11.5 90 top
J_-VLOAD  41,50 0 top
J_BATT/GND  4.7,3.7 0 top
L_12V  48.8,5 270 top
L_VBAT  2.4,18.4 0 top
MS1  65,4 0 bottom
MS2  4,51.5 0 bottom
MS3  65,51.5 0 bottom
NTC1  15.8,16.9 45 top
OUTH  32.5,32.5 0 top
OUTL  58.5,35 0 top
QA_H5  19.15,26.83 90 top
QA_H6  19.15,40.83 90 top
QA_L5  43.15,26.83 90 top
QA_L6  43.15,40.83 90 top
RG5  53.39,21.3 0 top
RG6  55.3,37.01 270 top
RG7  31,21 0 top
RG8  31.77,36.91 270 top
RGS5  49.5,18.64 180 top
RGS6  51.5,35.54 180 top
RGS7  26,21 180 top
RGS8  27.51,35.44 180 top
RLD1  2.4,13.2 270 top
RLD3  48.8,7.5 180 top
SRC1  33.5,42.5 180 top
SRC2  57.5,43 180 top
TP-GND1  62.9,43.6 90 top
TP-GND2  59.9,9.3 0 top
TP-OUTAH  31.5,17 270 top
TP-OUTAL  57,31.5 180 top
U$10  14.9,51.9 0 top
U$11  29,51.9 0 top

### Tracks (layer width: path | path; a pad name or v marks a point on that pad's centre or on a via)
+12VDRV  (via drill 0.35)
  Top 0.2: RLD3.2 46.91,7.71 v46.2,7
  Top 0.508: DRVR_X.5 38,13.46
  Top 0.813: 40,4.85 v40,7 40,17 C5.1 C6.1 | J_BATT/GND.11 18.14,2.96 36.11,2.96
  Bottom 0.2: v46.2,7 v40,7
  pour Top (isolate 0.5, no thermals): 37,13 37,18.5 40,18.5 40,13
  pour Top (isolate 0.5, no thermals): 39.5,19 39.5,4 40,3.5 43,3.5 43,9 40.5,11.5 40.5,19
  pour Top (isolate 0.5, no thermals): 43.1,5 43.1,-1.7 16.4,-1.7 16.4,4.9 43,4.9
GND  (via drill 0.25, 0.35)
  Top 0.152: GND3.P$1 v55,11.5 | v16,12.8 GND4.P$1
  Top 0.2: v61.9,30.8 62.1,31 62.1,32.4 62,32.4 GND5.P$1
  Top 0.406: DRVR_X.3 41.84,12.13 41.62,11.92 | v57.2,5.5 56.8,5.5 DZ15V4.2 56.8,5.1 v57.2,4.7
  Top 0.813: 48.03,18.7 RGS5.2 48.02,18.7 v47,18.7 | v51.5,5 L_12V.C
  Route2 0.152: v55,41.5 55,39.5
  Bottom 0.813: 21.5,6 21.26,6.24 J_BATT/GND.12 17.5,6.34 17.5,10
  other vias: 50,17 2.5,26.8 2.5,27.8 2.5,33.4 2.5,34.4 2.5,39.7 2.5,40.7 2.5,46 2.4,21.3 42,12.1 45.1,12.1 42.8,17.1 42,17.1 49.5,36.4 55,42.5 56,42.5 56,43.5 55,43.5 54,41.5 53,41.5 52,41.5 51,41.5 50,41.5 56,44.5 56,45.5 55,44.5 55,45.5 56,41.5 54,45.5 53,45.5 52,45.5 51,45.5 50,45.5 50,46.5 51,46.5 52,46.5 53,46.5 54,46.5 55,46.5 56,46.5 50,28 51,28 52,28 53,28 50,29 50,30 50,31 51,31 52,31 53,31 53,32 52,32 51,32 50,32 50,33 51,33 52,33 53,33
  pour Top (isolate 0.5, no thermals): 45.5,11.7 45.5,12.7 42,12.7 42,14.7 43,14.7 43,18.7 41,18.7 41,11.7
  pour Top (no thermals): -1,47 5,47 5,19 -2,19 -2,47
  pour Route15 (isolate 2): -4,57 -4,-3 72,-3 72,57
  pour Bottom (isolate 1.5, rank 5, no thermals): -4,57 -4,-3 72,-3 72,57
  pour Route2 (isolate 0.5, no thermals): 41,11.5 55,11.5 62,18.5 62,40 54.5,40 54.5,19 48.5,13 41,13
  pour Route2 (isolate 0.5, no thermals): 53,19.5 47,19.5 47,48 57,48 57,41.5 53,41.5
  pour Route2 (isolate 0.5, no thermals): 47,48 47,56.5 57,56.5 57,48
  pour Route2 (isolate 0.5, no thermals): 53,19.5 47.5,14 41,14 41,19.5 46,19.5 46,58 46.5,58.5 70,58.5 72,56.5 72,42 71.5,41.5 53,41.5
  pour Route2 (isolate 0.5, no thermals): 63.5,57.5 63.5,17.5 56,10 41,10 41,-6 86,-6 88,-4 88,39 69.5,57.5
  pour Top (isolate 0.5, no thermals): 53.5,27.5 47.5,27.5 47.5,57.5 59.5,57.5 59.5,40 49.5,40 49.5,34 53.5,34
IN_H
  Top 0.152: J_BATT/GND.10 14.86,9.14 INH.P$1
  Top 0.2: J_BATT/GND.10 16.05,5.05 16.05,3.21 16,3.15 16,1.9 43.6,1.9 44.2,2.5 44.2,9.6 DRVR_X.1
IN_L
  Top 0.152: 45.4,10.8 46.8,10.8 INL.P$1
  Top 0.2: J_BATT/GND.9 14.86,1.36 15,1.22 44.32,1.22 45.4,2.3 45.4,10.8 43.52,10.8 DRVR_X.2
N$1
  Top 0.813: DZ1.C 24,6.9 27.5,10.4 DZ2.A
N$2
  Top 0.813: DZ4.C 66.13,25.77 | 66.13,25.77 66.02,25.9 | DOV4.C 62.33,25.77 66.13,25.77
N$3
  Top 0.813: DZ3.C 66,20.75 DZ4.A
N$17
  Top 0.305: L_VBAT.A RLD1.1
N$20
  Top 0.305: RLD3.1 48.72,5 L_12V.A
N$31
  Top 0.406: DZ15V4.1 DZ15V3.1
N$38
  Top 0.813: DZ15V1.1 DZ15V2.1
N$43
  pour Top (isolate 0.254, no thermals): 51.5,34.5 51.5,39.5 56.5,39.5 56.5,37.5 53.5,37.5 53.5,34.5
N$44
  Top 0.813: QA_H6.1 28.94,37.39 RGS8.1
  pour Top (isolate 0.254, no thermals): 28,34.5 28,39 32,39 32,37.5 30,37.5 30,34.5
N$45
  Top 0.813: 28.34,23.99 QA_H5.1
  pour Top (isolate 0.254, no thermals): 29.5,20.5 29.5,25 28,25 28,20.5
N$46
  Top 0.813: RGS5.1 50.44,19.13
  pour Top (isolate 0.254, no thermals): 52.5,17.5 52.5,23.5 53.5,23.5 53.5,25.5 50.5,25.5 50.5,17.5
N$47
  Top 0.406: 20.1,10.55 19.9,10.55 DOV3.C
  Top 0.813: DZ2.C 20.25,10.4 20.1,10.55
NTC+
  Top 0.15: J_BATT/GND.7 11.1,4.92 | 11,5.02 11,10.5
  Top 0.2: 11.1,4.92 11,5.02 | NTC1.1 15.18,16.18 13.78,16.18 11,13.4 11,10.5
NTC-
  Top 0.15: J_BATT/GND.8 12.32,10.62
  Top 0.152: 16.49,17.5 NTC1.2
  Top 0.2: 16.49,17.5 17.2,16.79 15.11,14.7 13.4,14.7 12.32,13.62 12.32,10.62
  Top 0.406: 16.49,17 16.49,17.5
OUTA_H  (via drill 0.35)
  Top 0.406: DZ1.A 29.7,6.9 v29.8,6.8
  Top 0.61: DRVR_X.7 v36,10.87 34.53,10.87 31.6,13.8
  Top 0.813: DZ15V1.2 29.3,18.7 | 31.6,19.5 32.5,19.5
  Bottom 0.813: v36,10.87 35.06,10.87 31,6.8 v29.8,6.8
  pour Top (isolate 0.254, no thermals): 31,33.5 31,19 33.5,19 33.5,33.5
  pour Top (isolate 0.254, no thermals): 31,33 31,37 33.5,37 33.5,33
  pour Top (isolate 0.5, no thermals): 28.5,12 28.5,20 33.5,20 33.5,12
  pour Top (isolate 0.5, no thermals): 33,16 33,14 35.5,11.5 38.5,11.5 38.5,10 33,10 32.5,10.5 28.5,14.5 28.5,16
OUTA_L
  Top 0.406: DZ15V3.2 56.4,13.5 | 56.4,13.5
  Top 0.813: DZ3.A 64.77,13.5 56.4,13.5 54.1,13.5 54.1,15.8
  pour Top (isolate 0.254, no thermals): 54.5,33 54.5,36.5 56.5,36.5 56.5,33
  pour Top (isolate 0.254, no thermals): 54.5,36.5 54.5,19 59.5,19 59.5,36.5
  pour Top (isolate 0.5, no thermals): 43.5,13 59.3,13 59.5,13.2 59.5,26 54.5,26 54.5,19 52,16.5 44.5,16.5 43.5,15.5
VBOOT
  Top 0.508: 31.91,9.99 31.85,10.59 CBOOT1.1
  Top 0.61: DRVR_X.8 32.84,9.6 31.85,10.59
  pour Top (isolate 0.5, no thermals): 37.5,6 30.5,6 30.5,11.5 31,11.5 33,9.5 37.5,9.5
VDDA  (via drill 0.25, 0.35)
  Top 0.305: RLD1.2 2.42,11.78 v3.6,10.6
  Top 0.406: 20.95,15.15 DOV3.A
  Top 0.813: QA_H5.2 16.77,26.83 17.7,25.9 15.4,25.9 12.92,23.42 | v20,21 20,20.3 19.8,20.1 19.8,18.2 | 19.8,17 DOV3.A 20.4,15.75 20.4,19.3 | 19.8,18.2 18.9,18.2 | 18.9,18.2 18.7,18.2 18.7,18.6 18.2,18.6 | 18.2,18.6 17.9,18.6 17.1,19.4 | 18.2,18.6 18.9,17.9 | 18.9,17.9 19.8,17 | 18.9,18.2 18.9,17.9 | 19.8,17 19.8,18.2
  other vias: 12,46 12,45 12,44 12,43 12,42 12,41 12,40 12,39 12,38 12,37 12,36 13,34 13,35 13,36 13,37 13,38 13,39 13,40 13,41 13,42 13,43 13,44 13,45 13,46 14,46 14,45 14,44 14,43 14,42 14,41 14,40 14,39 14,38 14,37 14,36 14,35 14,34 15,46 15,45 15,44 15,43 15,42 15,41 15,40 15,39 15,38 15,37 15,36 15,35 15,34 16,34 16,35 16,36 16,37 16,38 16,39 16,40 16,41 16,42 16,43 16,44 16,45 16,46 17,46 17,45 17,44 17,43 17,42 17,41 17,40 17,39 17,38 17,37 17,36 17,35 17,34 18,46 18,45 18,44 18,43 18,42 18,41 18,40 18,39 18,38 18,37 18,36 18,35 18,34 19,34 19,35 19,36 19,37 19,38 19,39 19,40 19,41 19,42 19,43 19,44 19,45 19,46 20,46 20,45 20,44 20,43 20,42 20,41 20,40 20,39 20,38 20,37 20,36 20,35 20,34 12,32 12,31 12,30 12,29 12,28 12,27 12,26 12,25 12,24 12,23 12,22 12,21 13,21 13,22 13,23 13,24 13,25 13,26 13,27 13,28 13,29 13,30 13,31 13,32 13,33 14,33 14,32 14,31 14,30 14,29 14,28 14,27 14,26 14,25 14,24 14,23 14,22 14,21 15,33 15,32 15,31 15,30 15,29 15,28 15,27 15,26 15,25 15,24 15,23 15,22 15,21 16,21 16,22 16,23 16,24 16,25 16,26 16,27 16,28 16,29 16,30 16,31 16,32 16,33 17,33 17,32 17,31 17,30 17,29 17,28 17,27 17,26 17,25 17,24 17,23 17,22 17,21 18,33 18,32 18,31 18,30 18,29 18,28 18,27 18,26 18,25 18,24 18,23 18,22 18,21 19,21 19,22 19,23 19,24 19,25 19,26 19,27 19,28 19,29 19,30 19,31 19,32 19,33 20,33 20,32 20,31 20,30 20,29 20,28 20,27 20,26 20,25 20,24 20,23 20,22
  pour Top (isolate 1, no thermals): 22,18.5 22,54.7 6.5,54.7 6.5,18.5
  pour Top (isolate 1.5, no thermals): 15.2,20.4 15.2,-2 -3,-2 -3,18 6.5,18 6.5,20.4
  pour Top (no thermals): 8.6,1.7 8.6,9.2 10.1,10.7 1.7,10.7 1.7,1.9 1.9,1.7
  pour Bottom (isolate 2.5, no thermals): 11,21 11,47 21,47 21,20 11,20
  pour Top (isolate 0.3, no thermals): 9,10.5 17.5,10.5 17.5,23 9,23
VSS_A  (via drill 0.25, 0.35)
  Top 0.305: DZ15V2.2 30,13.3 v30,13
  Top 0.406: v61,21 61.95,21 DOV4.A
  Top 0.61: DRVR_X.6 36.02,12.13 CBOOT1.2
  Top 0.813: 41.5,27.1 41.5,27.5 41.1,27.5 41.1,28.1 39.83,29.37 | 23.3,34.7 23.3,29.5 23.43,29.37 QA_H5.3 | 23.3,34.7 23.3,35.44 RGS8.2 | 23.31,34.71 23.3,34.7 | DZ15V2.2 27.5,14 27.5,17.82 RGS7.2
  Route2 0.813: J_-VLOAD.2 J_-VLOAD.4 43.54,47.04 43.5,47 | J_-VLOAD.1 J_-VLOAD.3
  Bottom 0.406: v61,21 44.5,21 44,21.5 v44,24
  other vias: 36,46 36,45 36,44 36,43 36,42 36,41 36,40 36,39 36,38 36,37 36,36 36,35 37,36 37,37 37,38 37,39 37,40 37,41 37,42 37,43 37,44 37,45 37,46 38,46 38,45 38,44 38,43 38,42 38,41 38,40 38,39 38,38 38,37 38,36 38,35 39,46 39,45 39,44 39,43 39,42 39,41 39,40 39,39 39,38 39,37 39,36 39,35 39,34 40,34 40,35 40,36 40,37 40,38 40,39 40,40 40,41 40,42 40,43 40,44 40,45 40,46 41,46 41,45 41,44 41,43 41,42 41,41 41,40 41,39 41,38 41,37 41,36 41,35 41,34 42,46 42,45 42,44 42,43 42,42 42,41 42,40 42,39 42,38 42,37 42,36 42,35 42,34 43,34 43,35 43,36 43,37 43,38 43,39 43,40 43,41 43,42 43,43 43,44 43,45 43,46 44,46 44,45 44,44 44,43 44,42 44,41 44,40 44,39 44,38 44,37 44,36 44,35 44,34 36,32 36,31 36,30 36,29 36,28 36,27 36,26 36,25 36,24 36,23 36,22 36,21 37,21 37,22 37,23 37,24 37,25 37,26 37,27 37,28 37,29 37,30 37,31 38,32 38,31 38,30 38,29 38,28 38,27 38,26 38,25 38,24 38,23 38,22 38,21 39,33 39,32 39,31 39,30 39,29 39,28 39,27 39,26 39,25 39,24 39,23 39,22 39,21 40,21 40,22 40,23 40,24 40,25 40,26 40,27 40,28 40,29 40,30 40,31 40,32 40,33 41,33 41,32 41,31 41,30 41,29 41,28 41,27 41,26 41,25 41,24 41,23 41,22 41,21 42,33 42,32 42,31 42,30 42,29 42,28 42,27 42,26 42,25 42,24 42,23 42,22 42,21 43,21 43,22 43,23 43,24 43,25 43,26 43,27 43,28 43,29 43,30 43,31 43,32 43,33 44,33 44,32 44,31 44,30 44,29 44,28 44,27 44,26 44,25 44,23 44,22 44,21 29,33 28,33 27,33 27,32 28,32 29,32 29,31 28,31 27,31 27,42 28,42 29,42 30,42 31,42 31,43 31,44 31,45 30,45 29,45 28,45 27,45 27,46 28,46 29,46 30,46 31,46 32,46 32,45 32,44 32,43 32,42 29,28 28,28 27,28 26,28 25,28 25,29 25,30 25,31 26,31 26,32 25,32 25,33 26,33 34.5,15 35.5,15 35.5,16 34.5,16 34.5,17 35.5,17
  pour Top (isolate 1, rank 2, no thermals): 22.7,56.4 46.7,56.4 46.7,19 22.7,19
  pour Bottom (isolate 2.5): 35,20 45,20 45,47 35,47
  pour Top (no thermals): 35.5,12.5 36,13 36,17.5 34,17.5 34,13.5 35,12.5
  pour Route2 (isolate 1, no thermals): 36,17.5 36,13 36.5,12.5 39,12.5 39,10.5 31.5,10.5 26.5,15.5 26.5,23.5 30.5,27.5 30.5,34 26.5,38 26.5,39.5 34,39.5 34,17.5
  pour Route2 (isolate 2, no thermals): 35.5,20.5 44.5,20.5 44.5,56.5 23,56.5 23,40.5 35.5,40.5
  pour Route2 (isolate 0.5, no thermals): 23,40.5 23,27.5 29,27.5 29.5,28 29.5,33.5 28.5,34.5 25.5,37.5 25.5,38.5 25.5,40.5
  pour Route2 (isolate 0.5, no thermals): 33.5,19.5 39,19.5 39,10.5 33.5,10.5
  pour Route2 (isolate 0.5, no thermals): 23,26.5 33.5,26.5 33.5,10.5 23,10.5

### Text on the board
tNames: VSSA_H | VSSA_L | VDDA_L | GND | HALF-BRIDGE 0.0.2 | ***Vds OV Trip = 360V | ***Vds OV Trip = 360V | H | VDDA | L | 12V